# EAGLE design power_load (EAGLE 7.2.0)
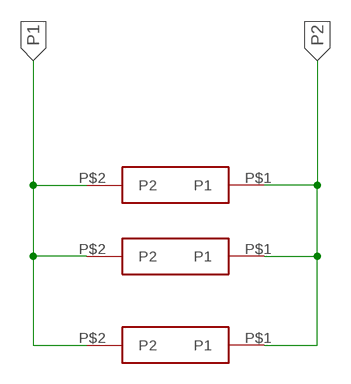
[diagram p0: schematic, sheet 1]

## Parts
U$1  ARCOL_10W  [10W_ARCOL]
U$2  ARCOL_10W  [10W_ARCOL]
U$3  ARCOL_10W  [10W_ARCOL]

## Nets
P1: U$1.P$2(P2) U$2.P$2(P2) U$3.P$2(P2)
P2: U$1.P$1(P1) U$2.P$1(P1) U$3.P$1(P1)

## Library data of the parts
U$1-U$3 = power_resistor:ARCOL_10W

## Board
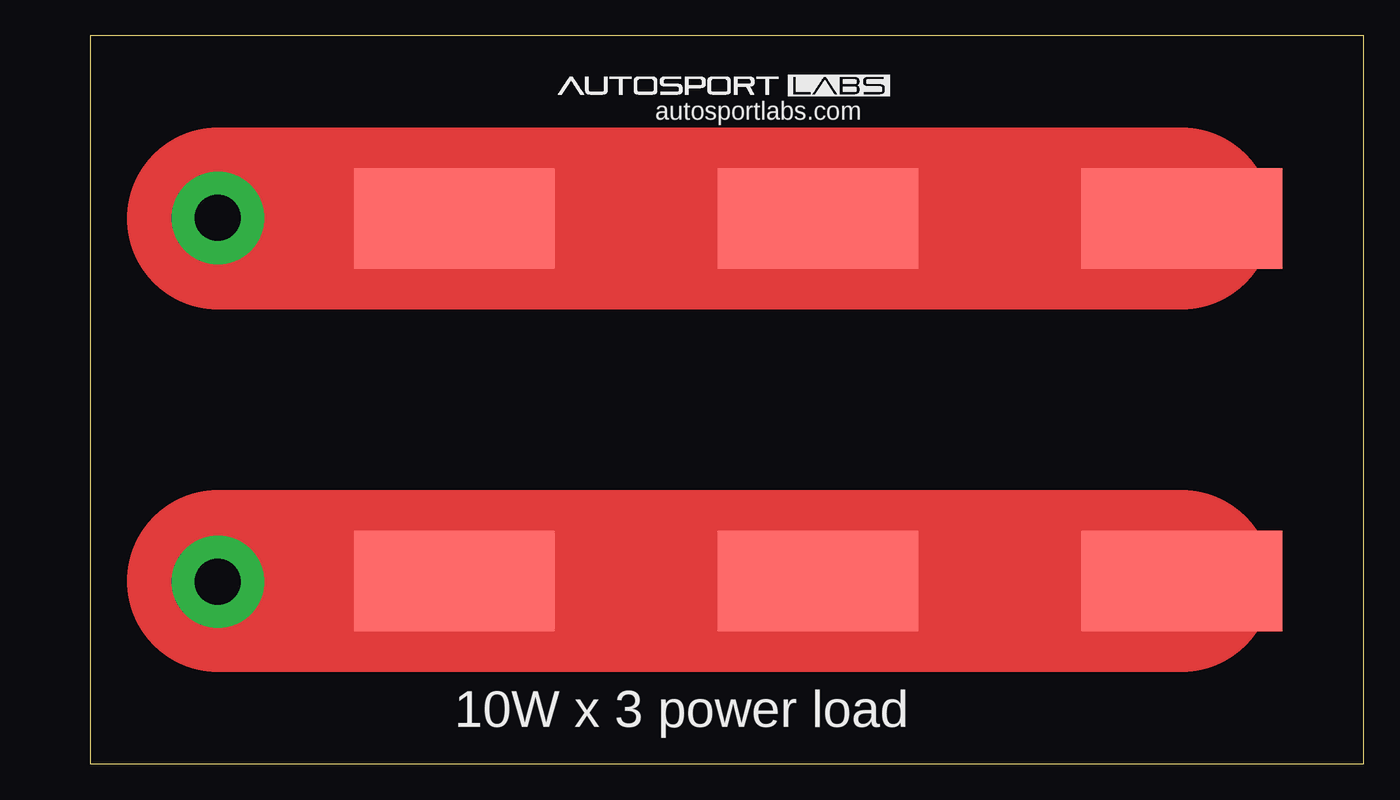
[diagram p1: board, top side]

Size 88.9 x 50.8 mm. Coordinates in mm from the lower left corner, seen from the top.
Outline: 0,0 88.9,0 88.9,50.8 0,50.8 0,0
Copper layers (1*16): Top 0.035mm / dielectric 1.5mm / Bottom 0.035mm
Design rules "default": minimum track width 10mil, minimum drill 24mil, track to track 8mil, track to pad 8mil, pad to pad 8mil, via to via 8mil, smd to smd 8mil, copper to edge 40mil, drill to drill 8mil, minimum pad ring 10mil, minimum via ring 8mil, stop-mask expansion 4mil, vias tented up to drill 0mil, thermal gap 10mil

### Footprints (pad centres in the part's own frame; a part is rotated, then mirrored left to right if it is on the bottom)
10W_ARCOL = smd 7 x 14: P$1 -12.65,0; P$2 12.65,0

### Placement (x,y rotation side)
U$1  25.4,25.4 90 top
U$2  50.8,25.4 90 top
U$3  76.2,25.4 90 top

### Tracks (layer width: path | path; a pad name or v marks a point on that pad's centre or on a via)
P1  (via drill 3.2 pad 6.45)
  Top 12.7: U$3.P$2 U$2.P$2 U$1.P$2 8.89,38.05
  Top 6.452: 8.89,38.05 v8.89,38.1
P2  (via drill 3.2 pad 6.45)
  Top 12.7: U$3.P$1 U$2.P$1 U$1.P$1 8.89,12.75
  Top 6.452: 8.89,12.75 v8.89,12.7

### Text on the board
tPlace: autosportlabs.com | 10W x 3 power load